# EAGLE design re-bent_hum_singe (EAGLE 9.6.2)
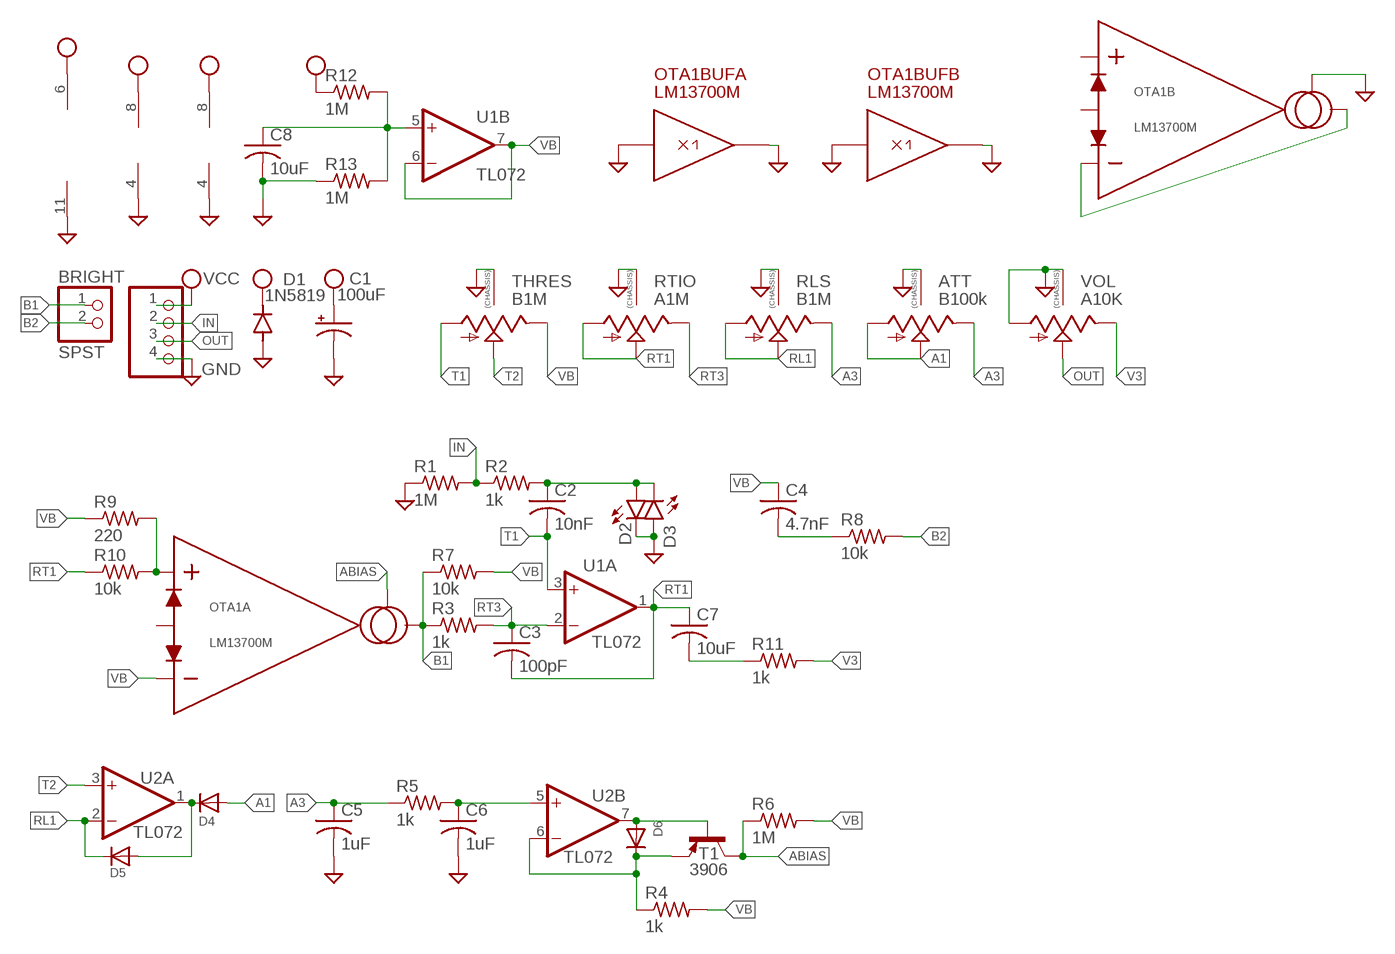
[diagram p0: schematic, sheet 1]

## Parts
ATT  B100k  9MM_SNAP-IN_POT_CHASSIS  [9MM_SNAP-IN_POT]
BRIGHT  SPST  PINHD-1X2  [1X02]
C1  100uF  CAP_SMD+THRUPAN_B  [PAN_B_SMD+THRU]
C2  10nF  C-USC0603  [C0603]
C3  100pF  C-USC0603  [C0603]
C4  4.7nF  C-USC0603  [C0603]
C5  1uF  C-USC0805  [C0805]
C6  1uF  C-USC0805  [C0805]
C7  10uF  C-USC1206  [C1206]
C8  10uF  C-USC1206  [C1206]
D1  1N5819  DIODE-SOD123  [SOD123]
D2  LED0603  [LED-0603]
D3  LED0603  [LED-0603]
D4  DIODESOD-123  [SOD-123]
D5  DIODESOD-123  [SOD-123]
D6  DIODESOD-123  [SOD-123]
JP1  PINHD-1X4  [1X04]
OTA1  LM13700M  [SO16]
R1  1M  R-US_R0603  [R0603]
R2  1k  R-US_R0603  [R0603]
R3  1k  R-US_R0603  [R0603]
R4  1k  R-US_R0603  [R0603]
R5  1k  R-US_R0603  [R0603]
R6  1M  R-US_R0603  [R0603]
R7  10k  R-US_R0603  [R0603]
R8  10k  R-US_R0603  [R0603]
R9  220  R-US_R0603  [R0603]
R10  10k  R-US_R0603  [R0603]
R11  1k  R-US_R0603  [R0603]
R12  1M  R-US_R0603  [R0603]
R13  1M  R-US_R0603  [R0603]
RLS  B1M  9MM_SNAP-IN_POT_CHASSIS  [9MM_SNAP-IN_POT]
RTIO  A1M  9MM_SNAP-IN_POT_CHASSIS  [9MM_SNAP-IN_POT]
T1  3906  MMBT3906LT1-PNP-SOT23-BEC  [SOT23-BEC]
THRES  B1M  9MM_SNAP-IN_POT_CHASSIS  [9MM_SNAP-IN_POT]
U1  TL072  TL072TSSOP  [TSSOP-8]
U2  TL072  TL072TSSOP  [TSSOP-8]
VOL  A10K  9MM_SNAP-IN_POT_CHASSIS  [9MM_SNAP-IN_POT]

## Nets
A1: ATT.1(A) ATT.2(S) D4.A
A3: ATT.3(E) C5.1 R5.1 RLS.3(E)
ABIAS: OTA1.1(A:IABC) R6.1 T1.C
B1: BRIGHT.1 OTA1.5(A:IOUT) R3.1 R7.1
B2: BRIGHT.2 R8.2
GND: ATT.CHASSIS1 ATT.CHASSIS2 C1.- C1.--(-) C5.2 C6.2 C8.2 D1.A D2.C D3.A JP1.4 OTA1.8(BUFA:OUT) OTA1.9(BUFB:OUT) OTA1.11(PWR:VEE) OTA1.16(B:IABC) R1.1 R13.1 RLS.CHASSIS1 RLS.CHASSIS2 RTIO.CHASSIS1 RTIO.CHASSIS2 THRES.CHASSIS1 THRES.CHASSIS2 U1.4(P:V-) U2.4(P:V-) VOL.1(A) VOL.CHASSIS1 VOL.CHASSIS2
IN: JP1.2 R1.2 R2.1
N$1: C8.1 R12.2 R13.2 U1.5(B:+IN)
N$2: C2.1 D2.A D3.C R2.2
N$3: OTA1.3(A:IN+) R9.2 R10.2
N$4: C7.2 R11.1
N$5: D4.C D5.A U2.1(A:OUT)
N$6: OTA1.12(B:IOUT) OTA1.13(B:IN-)
N$7: C6.1 R5.2 U2.5(B:+IN)
N$8: D6.C R4.1 T1.E U2.6(B:-IN)
N$9: D6.A T1.B U2.7(B:OUT)
N$10: C4.2 R8.1
OUT: JP1.3 VOL.2(S)
RL1: D5.C RLS.1(A) RLS.2(S) U2.2(A:-IN)
RT1: C3.2 C7.1 R10.1 RTIO.1(A) RTIO.2(S) U1.1(A:OUT)
RT3: C3.1 R3.2 RTIO.3(E) U1.2(A:-IN)
T1: C2.2 THRES.1(A) U1.3(A:+IN)
T2: THRES.2(S) U2.3(A:+IN)
V3: R11.2 VOL.3(E)
VB: C4.1 OTA1.4(A:IN-) R4.2 R6.2 R7.2 R9.1 THRES.3(E) U1.6(B:-IN) U1.7(B:OUT)
VCC: C1.+ C1.++(+) D1.C JP1.1 OTA1.6(PWR:VCC) R12.1 U1.8(P:V+) U2.8(P:V+)
Unconnected: OTA1.2(A:BIAS) OTA1.7(BUFA:IN) OTA1.10(BUFB:IN) OTA1.14(B:IN+) OTA1.15(B:BIAS)

## Library data of the parts
ATT RLS RTIO THRES VOL = MusicThingModular:9MM_SNAP-IN_POT_CHASSIS: 9mm vertical snap-in pot, Alpha / Panasonic style, with a connection to the metal chassis for grounding
BRIGHT = pinhead:PINHD-1X2: PIN HEADER
C1 = MusicThingModular:CAP_SMD+THRU
C2-C8 = adafruit:C-US: CAPACITOR, American symbol
D1 = diode:DIODE-: DIODE
D2 D3 = SparkFun-LED:LED: LED (Generic) Standard schematic elements and footprints for 5mm, 3mm, 1206, and 0603 sized LEDs. Generic LEDs with no color specified.
D4-D6 = adafruit:DIODE: Diode SMADIODE - SMA Surface Mount Package 20V 1A Schottky Diode Digikey: 641-1014-6-ND DO-1N4148 - Through Hole Small Current Diode SOD-123 20V 1 A (.5mV Vf) Schottky Diode - Digikey: MBRX120TPMSCT-ND SOD-323 10V 570mA (.38mV Vf, 3ns) Schottky Diode - Digikey: ZLLS410CT-ND SOD-523 30V 30mA Schottky Diode (RB751S-40TE61) - Digikey: RB751S-40TE61CT-ND SOT23-R/W - SOT23 Package (R = Solder Paste/Reflow Ovens, W = Hand-Soldering) BAT54Film 40V 300mA - Digikey: 497-7162-1-ND
JP1 = Connector:PINHD-1X4: PIN HEADER; CATEGORY: CONNECTOR; SUB-CATEGORY: PIN-HEADER
OTA1 = OTAs:LM13700: Dual OTA with linearizing diode and output buffers - 2MHz open-loop bandwidth - Linearizing diodes reduces distortion at higher differential input voltages - Darlington output buffers enables low-impedance output LM13700 or LM13600 The LM13700 differs from the LM13600 in that the 13700's output buffers are biased independently from the transconductance amplifier, allowing superior performance in audio applications. Originally released by National Semiconductor Manufactured by Texas Instruments.
R1-R13 = adafruit:R-US_: RESISTOR, American symbol
T1 = MusicThingModular:*-PNP-: PNP Transistror
U1 U2 = MusicThingModular:TL072: Generic Dual Op Amp

## Board
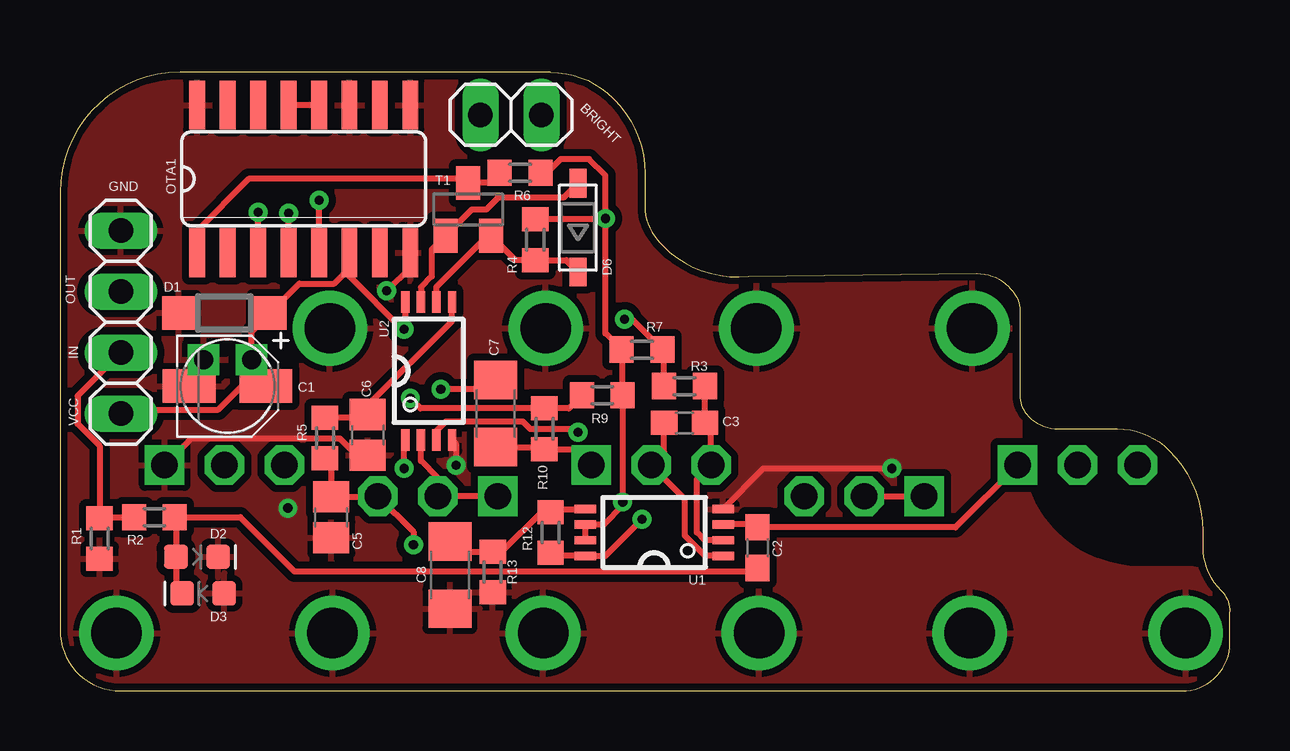
[diagram p1: board, top side]
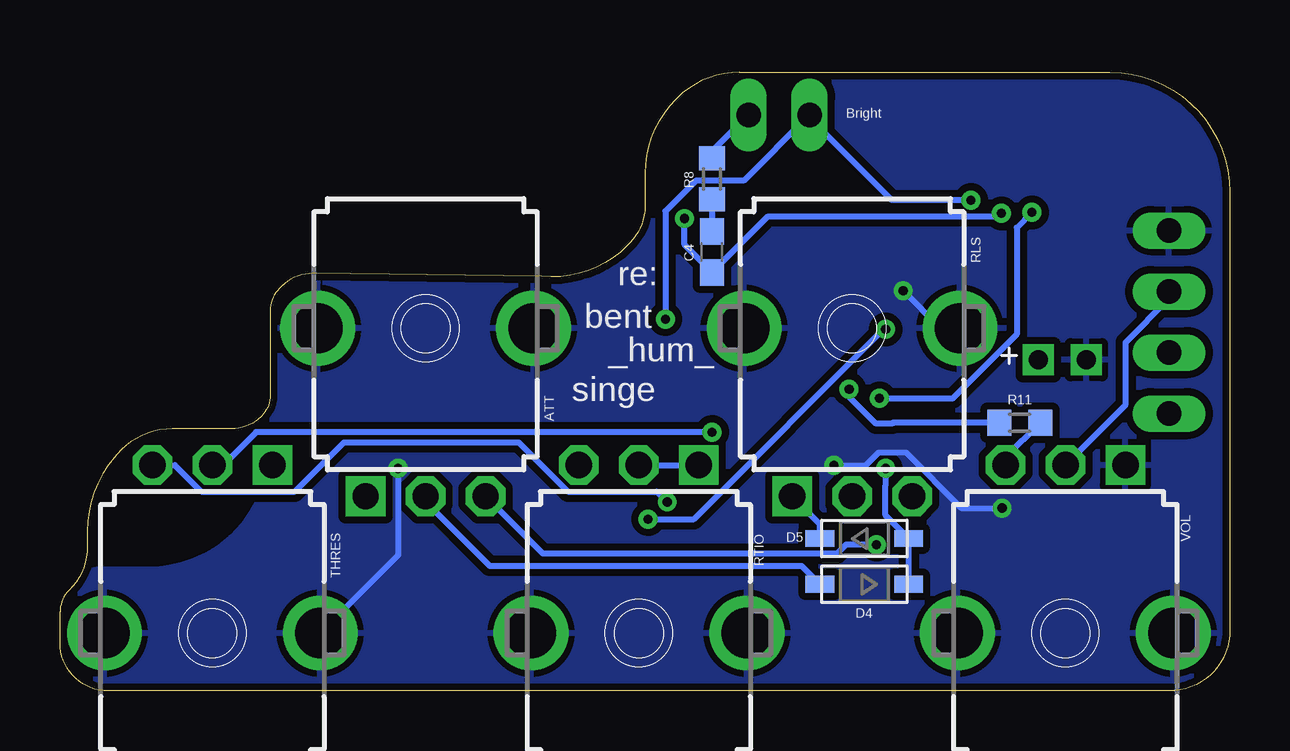
[diagram p2: board, bottom side, seen from below]

Size 48.77 x 25.78 mm. Coordinates in mm from the lower left corner, seen from the top.
Outline: 20.45,25.78 5,25.78 arc90 0,20.78 0,2.54 arc90 2.54,0 46.77,0 arc90 48.77,2 48.77,3.3 arc45 48.41,4.17 48.39,4.19 arc-45 47.62,6.03 47.62,6.66 arc45 46.23,10.03 arc45 44.08,10.92 41.61,10.92 arc-45 40.39,11.43 40.36,11.45 arc-45 40.01,12.32 40.01,15.84 arc45 39.62,16.76 39.53,16.86 arc45 38.23,17.4 28.69,17.27 arc-45 25.4,18.29 25.01,18.68 arc-45 24.38,20.19 24.38,21.57 arc45 23.11,24.64 23.05,24.7 arc45 20.45,25.78
Copper layers (1*16): Top 0.035mm / dielectric 1.5mm / Bottom 0.035mm
Design rules "default *": minimum track width 6mil, minimum drill 0.35mm, track to track 6mil, track to pad 6mil, pad to pad 6mil, via to via 6mil, smd to smd 6mil, copper to edge 10mil, drill to drill 6mil, minimum pad ring 10mil, minimum via ring 8mil, stop-mask expansion 4mil, vias tented up to drill 0mil, thermal gap 10mil

### Footprints (pad centres in the part's own frame; a part is rotated, then mirrored left to right if it is on the bottom)
9MM_SNAP-IN_POT = drill 1.1 square: 1 -2.5,-7 | drill 1.1 octagon: 2 0,-7; 3 2.5,-7 | drill 2.1 pad 2.794: CHASSIS1 -4.5,0; CHASSIS2 4.5,0
1X02 = drill 1.016 long: 1 -1.27,0; 2 1.27,0
PAN_B_SMD+THRU = smd 2.2 x 1.4: + 1.6,0; - -1.6,0 | drill 0.8 pad 0.9 square: ++ 1,1.1; -- -1,1.1
C0603 = smd 1.1 x 1: 1 -0.85,0; 2 0.85,0
C0805 = smd 1.3 x 1.5: 1 -0.85,0; 2 0.85,0
C1206 = smd 1.6 x 1.8: 1 -1.4,0; 2 1.4,0
SOD123 = smd 1.4 x 1.4: A 1.9,0; C -1.9,0
LED-0603 = smd 1 x 1: A -0.877,0; C 0.877,0
SOD-123 = smd 1.2 x 0.7: A 1.85,0; C -1.85,0
1X04 = drill 1.016 long: 1 -3.81,0; 2 -1.27,0; 3 1.27,0; 4 3.81,0
SO16 = smd 0.66 x 2.032: 1 -4.445,-3.073; 2 -3.175,-3.073; 3 -1.905,-3.073; 4 -0.635,-3.073; 5 0.635,-3.073; 6 1.905,-3.073; 7 3.175,-3.073; 8 4.445,-3.073; 9 4.445,3.073; 10 3.175,3.073; 11 1.905,3.073; 12 0.635,3.073; 13 -0.635,3.073; 14 -1.905,3.073; 15 -3.175,3.073; 16 -4.445,3.073
R0603 = smd 1 x 1.1: 1 -0.85,0; 2 0.85,0
SOT23-BEC = smd 1 x 1.4: B -0.95,-1.1; C 0,1.1; E 0.95,-1.1
TSSOP-8 = smd 0.9 x 0.35: 1 -2.875,0.975; 2 -2.875,0.325; 3 -2.875,-0.325; 4 -2.875,-0.975; 5 2.875,-0.975; 6 2.875,-0.325; 7 2.875,0.325; 8 2.875,0.975

### Placement (x,y rotation side)
ATT  33.53,15.11 0 bottom
BRIGHT  18.8,24 0 top
C1  6.99,12.7 0 top
C2  29.08,5.97 90 top
C3  26.04,11.18 180 top
C4  21.59,18.29 90 bottom
C5  11.3,7.24 270 top
C6  12.83,10.67 270 top
C7  18.16,11.56 90 top
C8  16.26,4.83 270 top
D1  6.86,15.75 180 top
D2  5.71,5.59 0 top
D3  5.97,4.06 180 top
D4  15.24,4.45 180 bottom
D5  15.24,6.35 0 bottom
D6  21.59,19.3 90 top
JP1  2.54,15.37 90 top
OTA1  10.16,21.34 0 top
R1  1.65,6.35 90 top
R2  3.94,7.24 0 top
R3  26.04,12.7 0 top
R4  19.81,18.8 90 top
R5  11.05,10.54 90 top
R6  19.18,21.59 0 top
R7  24.26,14.22 180 top
R8  21.59,21.34 90 bottom
R9  22.61,12.32 180 top
R10  20.19,10.92 90 top
R11  8.76,11.18 0 bottom
R12  20.45,6.6 90 top
R13  18.03,4.95 90 top
RLS  15.75,15.11 0 bottom
RTIO  24.64,2.41 180 bottom
T1  17.02,20.07 0 top
THRES  42.42,2.41 180 bottom
U1  24.77,6.6 180 top
U2  15.37,13.34 90 top
VOL  6.86,2.41 180 bottom

### Tracks (layer width: path | path; a pad name or v marks a point on that pad's centre or on a via)
A1
  Top 0.254: ATT.2 ATT.1
  Bottom 0.254: D4.A 17.85,5.21 30.86,5.21 33.53,7.87 ATT.2
A3  (via drill 0.38)
  Top 0.254: R5.1 11.3,9.44 C5.1 13.22,8.09 RLS.3 14.73,6.63 v14.73,6.1
  Bottom 0.254: v14.73,6.1 16,6.1 16.37,5.72 21.59,5.72 28.64,5.72 ATT.3
ABIAS
  Top 0.254: R6.1 17.9,21.17 T1.C 16.85,21.34 7.87,21.34 5.71,19.18 OTA1.1
B1  (via drill 0.38)
  Top 0.254: R3.1 25.18,14.15 R7.1 23.84,15.49 v23.53,15.49 | OTA1.5 v10.79,20.45
  Bottom 0.254: BRIGHT.1 17.59,23.94 | 17.59,23.94 20.26,21.27 22.26,21.27 23.53,19.99 v23.53,15.49 | v10.79,20.45 14.1,20.45 17.59,23.94
B2
  Bottom 0.254: BRIGHT.2 21.59,22.48 R8.2
GND  (via drill 0.38)
  Top 0.152: C1.- 5.99,13.3 C1.--
  Top 0.254: OTA1.8 14.61,17.65 v13.62,16.67 | C6.2 12.37,9.82 11.67,10.52 5.46,10.52 VOL.1 | U2.4 16.51,10.29 v16.51,9.4 | U1.4 29.33,9.27 v34.67,9.27
  Bottom 0.254: v13.62,16.67 12.06,15.11 RLS.CHASSIS2 | v9.5,7.62 11.19,7.62 13.52,9.94 14.63,9.94 15.18,9.4 v16.51,9.4 | v34.67,9.27 34.67,5.66 THRES.CHASSIS1
  pour Top (isolate 0.305): -1.27,25.78 -1.27,-1.27 49.53,-1.27 49.53,2.54 arc90 46.99,5.08 45.01,5.08 arc-90 40.01,10.08 40.01,15.88 arc90 38.86,17.02 28.78,17.02 arc-90 24.13,21.67 arc90 20.02,25.78
  pour Bottom (isolate 0.305): -1.27,25.78 -1.27,-1.27 49.53,-1.27 49.53,2.54 arc90 46.99,5.08 45.01,5.08 arc-90 40.01,10.08 40.01,15.88 arc90 38.86,17.02 28.78,17.02 arc-90 24.13,21.67 arc90 20.02,25.78
IN
  Top 0.254: JP1.2 0.74,12.29 0.74,11.13 1.65,10.21 R1.2 1.69,7.24 R2.1
N$1
  Top 0.254: C8.1 16.43,6.4 17.02,5.8 R13.2 18.41,5.8 20.07,7.45 R12.2 20.57,7.58 U1.5
N$2
  Top 0.254: D3.C 4.84,4.32 D2.A 4.84,7.19 R2.2 7.51,7.24 9.78,4.97 28.94,4.97 C2.1
N$3  (via drill 0.38)
  Top 0.254: R9.2 21.21,11.77 R10.2 15.03,11.77 v14.61,12.19 | OTA1.3 v8.26,19.94
  Bottom 0.254: v8.26,19.94 8.89,19.3 8.89,14.86 11.56,12.19 v14.61,12.19
N$4  (via drill 0.38)
  Top 0.254: C7.2 17.78,12.57 v15.88,12.57
  Bottom 0.254: v15.88,12.57 15.88,12.26 14.76,11.14 14.07,11.14 14.03,11.18 R11.1
N$5  (via drill 0.38)
  Top 0.254: v14.35,9.27 14.35,10.42 U2.1
  Bottom 0.254: D4.C D5.A 14.35,7.31 14.35,8.57 v14.35,9.27
N$6
  Top 0.254: OTA1.12 OTA1.13
N$7
  Top 0.254: U2.5 16.34,15.41 12.83,11.9 C6.1 12.7,11.39 R5.2
N$8
  Top 0.254: U2.6 15.69,16.84 17.82,18.97 T1.E 18.99,17.95 R4.1 21.1,17.95 D6.C
N$9
  Top 0.254: U2.7 15.04,16.82 15.49,17.27 15.49,18.39 T1.B 17.16,20.06 17.76,20.06 18.26,20.55 20.99,20.55 D6.A
N$10
  Bottom 0.254: R8.1 C4.2
OUT
  Bottom 0.254: VOL.2 4.34,11.93 4.34,14.53 2.54,16.33 JP1.3
RL1
  Top 0.254: RLS.1 RLS.2 15.75,8.88 15.04,9.58 U2.2
  Bottom 0.254: D5.C 17.09,6.96 RLS.1
RT1
  Top 0.254: C7.1 20.11,10.16 R10.1 21.48,10.07 RTIO.1 | C3.2 25.18,9.96 RTIO.2 26.04,8.02 26.04,6.48 26.88,5.63 U1.1
  Bottom 0.254: RTIO.2 RTIO.1
RT3
  Top 0.254: R3.2 C3.1 27.14,10.92 RTIO.3 26.54,8.82 26.54,6.6 26.87,6.28 U1.2
T1
  Top 0.254: U1.3 27.66,6.95 28.96,6.95 C2.2 37.32,6.82 THRES.1
T2  (via drill 0.38)
  Top 0.254: U2.3 15.69,10.84 16.09,11.24 19.28,11.24 19.61,10.91 21.46,10.91 v21.59,10.78
  Bottom 0.254: v21.59,10.78 40.59,10.78 41.96,9.41 THRES.2
V3
  Bottom 0.254: R11.2 9.36,9.73 VOL.3
VB  (via drill 0.38)
  Top 0.254: U1.7 U1.6 22.68,6.93 23.46,7.71 v23.46,7.87 R9.1 23.46,14.18 R7.2 22.73,14.9 v22.73,19.68 | v22.73,19.68 22.73,21.48 22.06,22.16 20.87,22.16 20.3,21.59 R6.2 | v22.73,19.68 22.69,19.65 R4.2 | OTA1.4 v9.53,19.9
  Bottom 0.254: v22.73,19.68 22.73,18.58 C4.1 19.25,19.77 9.65,19.77 v9.53,19.9 | THRES.3 43.98,9.41 42.88,8.31 38.98,8.31 36.92,10.36 29.65,10.36 27.59,8.31 23.89,8.31 v23.46,7.87
VCC  (via drill 0.38)
  Top 0.254: R12.1 20.57,5.63 U1.8 22.73,5.63 v24.26,7.16 | JP1.1 2.7,11.72 6.6,11.72 7.58,12.7 C1.+ 7.99,13.3 C1.++ 7.99,14.97 D1.C 9.98,16.97 11.43,16.97 12.06,17.6 OTA1.6 12.06,17.27 14.27,15.07 v14.35,15.07 14.39,15.11 U2.8
  Bottom 0.254: v24.26,7.16 22.35,7.16 14.44,15.07 v14.35,15.07

### Text on the board
tPlace: GND | OUT | IN | VCC
bPlace: Bright | re: | bent | _hum_ | singe